# Altium schematic sheet POWER.SchDoc
size A4
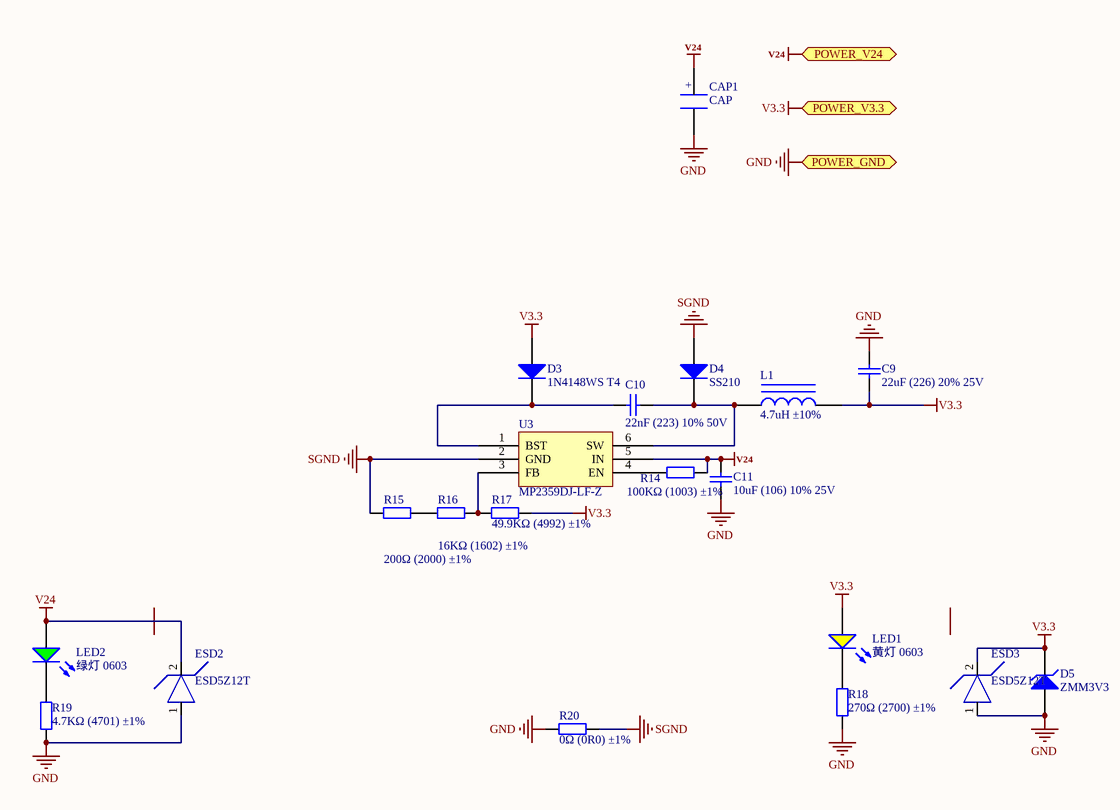
[diagram p0: POWER.SchDoc]

## Parts
C9  22uF (226) 20% 25V  [0805_C]
C10  22nF (223) 10% 50V  [0603_C]
C11  10uF (106) 10% 25V  [0805_C]
CAP1  CAP  [8X12_CAP]
D3  1N4148WS T4  [SOD-323]
D4  SS210  [SMA(DO-214AC)_S1]
D5  ZMM3V3  [LL-34]
ESD2  ESD5Z12T  [SOD-523]
ESD3  ESD5Z12T  [SOD-523]
L1  4.7uH ±10%  [L_4030]
LED1  黄灯 0603  [0603_LED_S1]
LED2  绿灯 0603  [0603_LED_S1]
R14  100KΩ (1003) ±1%  [0603_R]
R15  200Ω (2000) ±1%  [0603_R]
R16  16KΩ (1602) ±1%  [0603_R]
R17  49.9KΩ (4992) ±1%  [0603_R]
R18  270Ω (2700) ±1%  [0805_R]
R19  4.7KΩ (4701) ±1%  [0805_R]
R20  0Ω (0R0) ±1%  [0603_R]
U3  MP2359DJ-LF-Z  [SOT-23-6]

## Ports
POWER_GND, POWER_V3.3, POWER_V24

## Nets
GND: C9.2 C11.1 CAP1.2 D5.1(A) ESD2.1 ESD3.1 R18.1 R19.1 R20.1 ; port POWER_GND
SGND: D4.1(A) R15.2 R20.2 U3.2(GND)
V3.3: C9.1 D3.1(A) D5.2(K) ESD3.2 L1.2 LED1.A R17.2 ; port POWER_V3.3
V24: C11.2 CAP1.1 ESD2.2 LED2.A R14.2 U3.5(IN) ; port POWER_V24
NetC10_1: C10.1 D3.2(K) U3.1(BST)
NetC10_2: C10.2 D4.2(K) L1.1 U3.6(SW)
NetLED1_K: LED1.K R18.2
NetLED2_K: LED2.K R19.2
NetR14_1: R14.1 U3.4(EN)
NetR15_1: R15.1 R16.2
NetR16_1: R16.1 R17.1 U3.3(FB)

## Notes on the sheet
- (in symbol CAP) +

## Library data of the parts
C9 = 0805 22uF (226) 20% 25V: 贴片电容; ComponentLink1Description: 供应商链接; ComponentLink1URL: http://www.szlcsc.com/product/details_46786.html; Package: 0805; Supplier: LC; SuppliersPartNumber: C45783
C10 = 0603 22nF (223) 10% 50V: 贴片电容; ComponentLink1Description: 供应商链接; ComponentLink1URL: http://www.szlcsc.com/product/details_21834.html; Package: 0603; Supplier: LC; SuppliersPartNumber: C21122
C11 = 0805 10uF (106) 10% 25V: 贴片电容; ComponentLink1Description: 供应商链接; ComponentLink1URL: http://www.szlcsc.com/product/details_16532.html; Package: 0805; Supplier: LC; SuppliersPartNumber: C15850
D3 = SOD-323 1N4148WS T4: 二极管; ComponentLink1Description: 供应商链接; ComponentLink1URL: http://www.szlcsc.com/product/details_2485.html; Package: SOD-323; Supplier: LC; SuppliersPartNumber: C2128
D4 = SMA(DO-214AC) SS210: 二极管; ComponentLink1Description: 供应商链接; ComponentLink1URL: http://www.szlcsc.com/product/details_15669.html; Package: SMA(DO-214AC); Supplier: LC; SuppliersPartNumber: C14996
D5 = LL-34 ZMM3V3: 稳压二极管; ComponentLink1Description: 供应商链接; ComponentLink1URL: http://www.szlcsc.com/product/details_8535.html; Package: LL-34; Supplier: LC; SuppliersPartNumber: C8056
ESD2 ESD3 = ESD-D
L1 = 0603 4.7uH 10%: 贴片电感; ComponentLink1Description: 供应商链接; ComponentLink1URL: http://www.szlcsc.com/product/details_1386.html; Package: 0603; Supplier: LC; SuppliersPartNumber: C1034
LED1 = 0603 黄灯: 发光二极管; ComponentLink1Description: 供应商链接; ComponentLink1URL: http://www.szlcsc.com/product/details_73147.html; Package: 0603; Supplier: LC; SuppliersPartNumber: C72038
LED2 = 0603 绿灯: 发光二极管; ComponentLink1Description: 供应商链接; ComponentLink1URL: http://www.szlcsc.com/product/details_73152.html; Package: 0603; Supplier: LC; SuppliersPartNumber: C72043
R14 = 0603 100KΩ (1003) 1%: 贴片电阻; ComponentLink1Description: 供应商链接; ComponentLink1URL: http://www.szlcsc.com/product/details_26546.html; Package: 0603; Supplier: LC; SuppliersPartNumber: C25803
R15 = 0603 200Ω (2000) 1%: 贴片电阻; ComponentLink1Description: 供应商链接; ComponentLink1URL: http://www.szlcsc.com/product/details_8708.html; Package: 0603; Supplier: LC; SuppliersPartNumber: C8218
R16 = 0603 16KΩ (1602) 1%: 贴片电阻; ComponentLink1Description: 供应商链接; ComponentLink1URL: http://www.szlcsc.com/product/details_23545.html; Package: 0603; Supplier: LC; SuppliersPartNumber: C22818
R17 = 0603 49.9KΩ (4992) 1%: 贴片电阻; ComponentLink1Description: 供应商链接; ComponentLink1URL: http://www.szlcsc.com/product/details_23911.html; Package: 0603; Supplier: LC; SuppliersPartNumber: C23184
R18 = 0805 270Ω (2700) 1%: 贴片电阻; ComponentLink1Description: 供应商链接; ComponentLink1URL: http://www.szlcsc.com/product/details_18278.html; Package: 0805; Supplier: LC; SuppliersPartNumber: C17590
R19 = 0805 4.7KΩ (4701) 1%: 贴片电阻; ComponentLink1Description: 供应商链接; ComponentLink1URL: http://www.szlcsc.com/product/details_18361.html; Package: 0805; Supplier: LC; SuppliersPartNumber: C17673
R20 = 0603 0Ω (0R0) 1%: 贴片电阻; ComponentLink1Description: 供应商链接; ComponentLink1URL: http://www.szlcsc.com/product/details_21903.html; Package: 0603; Supplier: LC; SuppliersPartNumber: C21189
U3 = MP2359DJ-LF-Z_[C14259]: DC-DC芯片; ComponentLink1Description: 供应商链接; ComponentLink1URL: http://www.szlcsc.com/product/details_14917.html; Package: SOT-23-6; Supplier: LC; SuppliersPartNumber: C14259